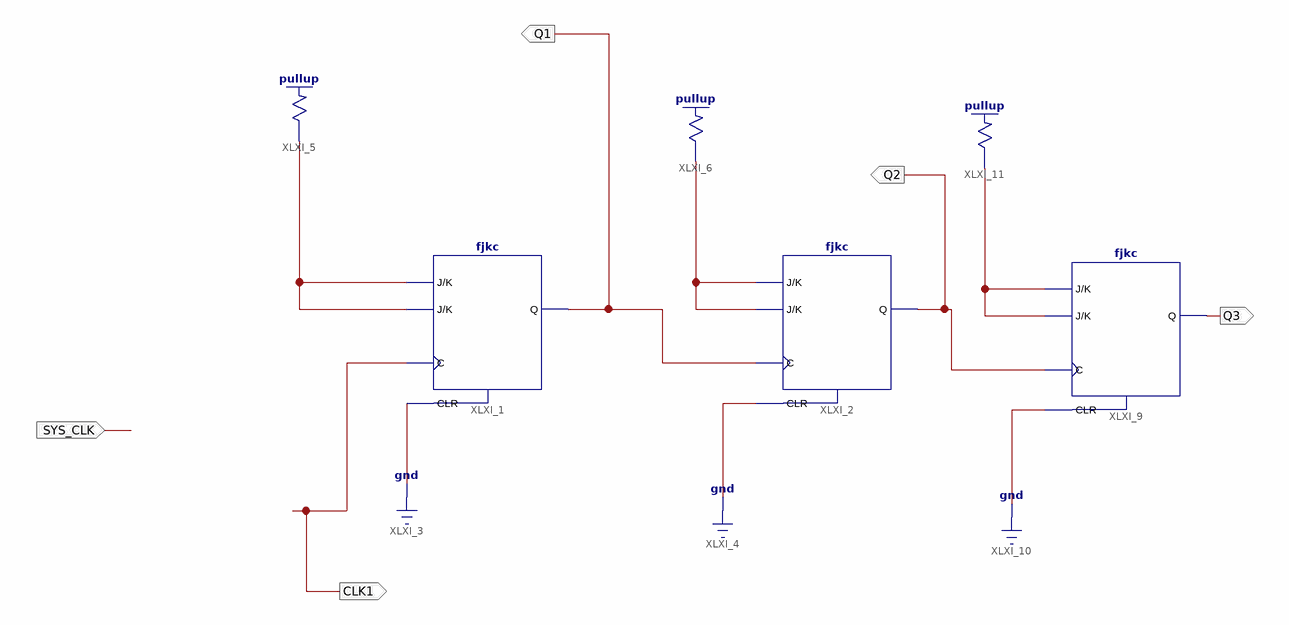
[diagram p0: schematic sheet 1]
// Xilinx ISE schematic Experiment2.sch (spartan3e) as structural Verilog: 6 symbols, 5 ports
module Experiment2 (
  input  SYS_CLK,
  output Q1,
  output CLK1,
  output Q2,
  output Q3
);

  wire XLXN_3, XLXN_4, XLXN_11;

  fjkc XLXI_1 (.C(CLK1), .CLR(1'b0), .J(XLXN_3), .K(XLXN_3), .Q(Q1));
  fjkc XLXI_2 (.C(Q1), .CLR(1'b0), .J(XLXN_4), .K(XLXN_4), .Q(Q2));
  \pullup  XLXI_5 (.O(XLXN_3));
  \pullup  XLXI_6 (.O(XLXN_4));
  fjkc XLXI_9 (.C(Q2), .CLR(1'b0), .J(XLXN_11), .K(XLXN_11), .Q(Q3));
  \pullup  XLXI_11 (.O(XLXN_11));
endmodule
